# EAGLE design Op-Amp Clock Generator (EAGLE 9.6.2)
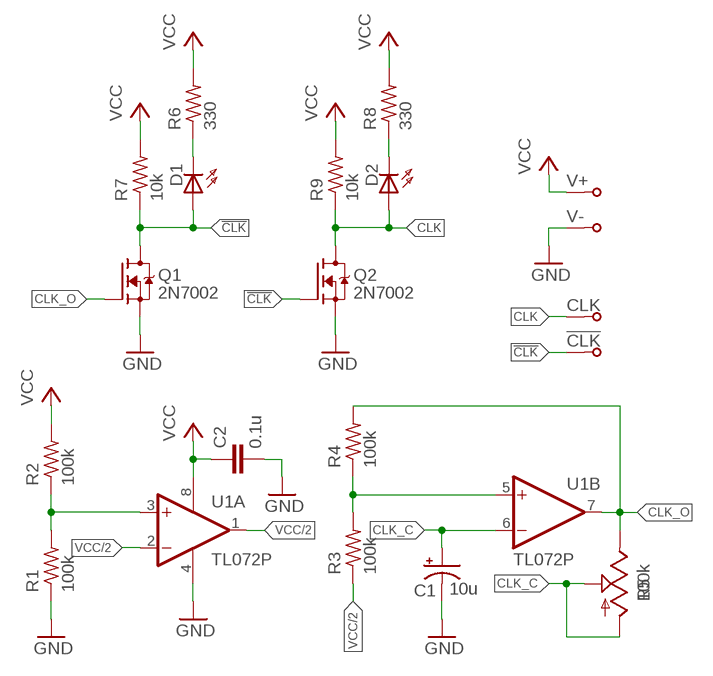
[diagram p0: schematic, sheet 1]

## Parts
!CLK  TPTHT  [PROTOPAD-THT-PAD]
C1  10u  CAP_POLLYTIC_V  [TT2D5]
C2  0.1u  CAP0603  [C0603]
CLK  TPTHT  [PROTOPAD-THT-PAD]
D1  LED0603  [CHIP-LED0603]
D2  LED0603  [CHIP-LED0603]
Q1  2N7002  [SOT23]
Q2  2N7002  [SOT23]
R1  100k  RES0603  [R0603]
R2  100k  RES0603  [R0603]
R3  100k  RES0603  [R0603]
R4  100k  RES0603  [R0603]
R5  100k  ALPHA_POT_VERTICALVERTICAL  [ALPHA_POT_VERTICAL]
R6  330  RES0603  [R0603]
R7  10k  RES0603  [R0603]
R8  330  RES0603  [R0603]
R9  10k  RES0603  [R0603]
U1  TL072P  [DIL08]
V+  TPTHT  [PROTOPAD-THT-PAD]
V-  TPTHT  [PROTOPAD-THT-PAD]

## Nets
!CLK: !CLK.P1(S) D1.A Q1.3(D) Q2.1(G) R7.1
CLK: CLK.P1(S) D2.A Q2.3(D) R9.1
CLK_C: C1.+ R5.P$2(S) R5.P$3(A) U1.6(B:-IN)
CLK_O: Q1.1(G) R4.2 R5.P$1(E) U1.7(B:OUT)
GND: C1.- C2.2 Q1.2(S) Q2.2(S) R1.1 U1.4(P:V-) V-.P1(S)
N$1: R1.2 R2.1 U1.3(A:+IN)
N$2: R3.2 R4.1 U1.5(B:+IN)
N$3: D1.C(K) R6.1
N$6: D2.C(K) R8.1
VCC: C2.1 R2.2 R6.2 R7.2 R8.2 R9.2 U1.8(P:V+) V+.P1(S)
VCC/2: R3.1 U1.1(A:OUT) U1.2(A:-IN)

## Library data of the parts
!CLK CLK V+ V- = ellajameson-core:TP
C1 = ellajameson-core:CAP_POL: POLARIZED CAPACITOR, American symbol
C2 = ellajameson-core:CAP
D1 D2 = ellajameson-core:LED
Q1 Q2 = ellajameson-core:2N7002
R1-R4 R6-R9 = ellajameson-core:RES
R5 = ellajameson-core:ALPHA_POT_VERTICAL
U1 = ellajameson-core:TL072: OP AMP

## Board
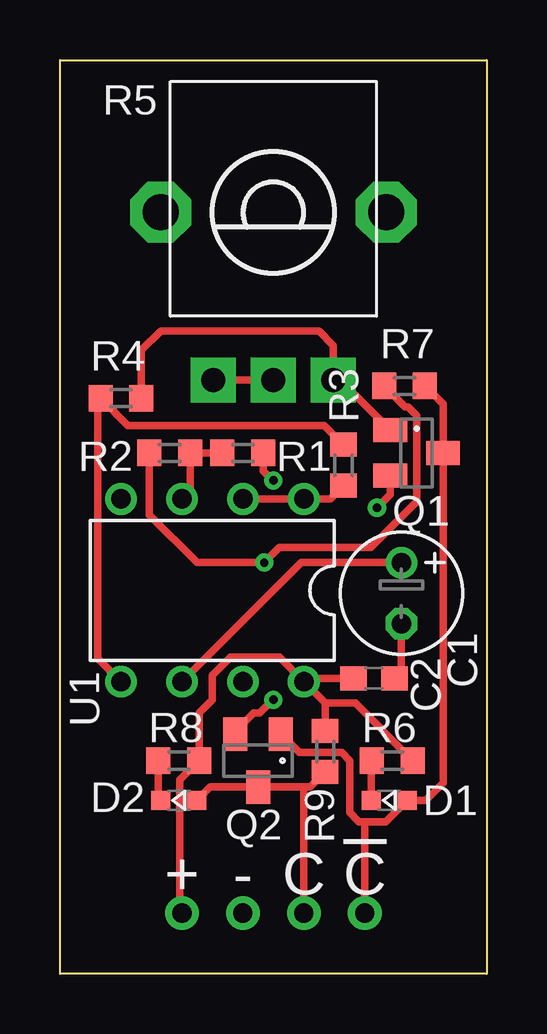
[diagram p1: board, top side]
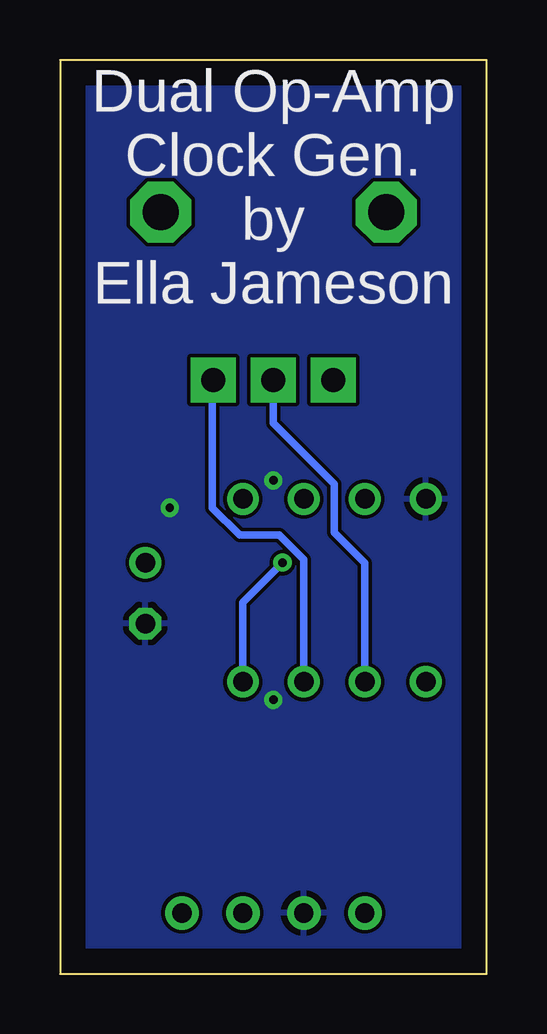
[diagram p2: board, bottom side, seen from below]

Size 17.78 x 38.1 mm. Coordinates in mm from the lower left corner, seen from the top.
Outline: 0,0 0,38.1 17.78,38.1 17.78,0 0,0
Copper layers (1*16): Top 0.035mm / dielectric 1.5mm / Bottom 0.035mm
Design rules "default": minimum track width 6mil, minimum drill 0.35mm, track to track 6mil, track to pad 6mil, pad to pad 6mil, via to via 6mil, smd to smd 6mil, copper to edge 40mil, drill to drill 6mil, minimum pad ring 10mil, minimum via ring 8mil, stop-mask expansion 4mil, vias tented up to drill 0mil, thermal gap 10mil

### Footprints (pad centres in the part's own frame; a part is rotated, then mirrored left to right if it is on the bottom)
PROTOPAD-THT-PAD = drill 0.8 pad 1.4: P1 0,0
TT2D5 = drill 0.813: + -1.27,0 | drill 0.813 octagon: - 1.27,0
C0603 = smd 1.1 x 1: 1 -0.85,0; 2 0.85,0
CHIP-LED0603 = smd 0.8 x 0.8: A 0,-0.75; C 0,0.75
SOT23 = smd 1 x 1.4: 1 -0.95,-1.1; 2 0.95,-1.1; 3 0,1.1
R0603 = smd 1 x 1.1: 1 -0.85,0; 2 0.85,0
ALPHA_POT_VERTICAL = drill 1 pad 1.88 square: P$1 -2.5,7; P$2 0,7; P$3 2.5,7 | drill 1.5 pad 2.54 octagon: P$4 -4.7,0; P$5 4.7,0
DIL08 = drill 0.813 pad 1.27: 1 -3.81,-3.81; 2 -1.27,-3.81; 3 1.27,-3.81; 4 3.81,-3.81; 5 3.81,3.81; 6 1.27,3.81; 7 -1.27,3.81; 8 -3.81,3.81

### Placement (x,y rotation side)
!CLK  12.7,2.54 0 top
C1  14.22,15.88 270 top
C2  13.08,12.32 0 top
CLK  10.16,2.54 0 top
D1  13.72,7.24 90 top
D2  4.95,7.24 90 top
Q1  14.86,21.72 270 top
Q2  8.26,8.89 180 top
R1  7.62,21.72 180 top
R2  4.57,21.72 180 top
R3  11.81,21.21 90 top
R4  2.54,24 0 top
R5  8.89,31.75 180 top
R6  13.84,8.89 0 top
R7  14.35,24.51 180 top
R8  4.95,8.89 0 top
R9  11.05,9.27 90 top
U1  6.35,15.99 180 top
V+  5.08,2.54 0 top
V-  7.62,2.54 0 top

### Tracks (layer width: path | path; a pad name or v marks a point on that pad's centre or on a via)
!CLK
  Top 0.305: R7.1 15.96,23.75 Q1.3 15.96,7.96 15.24,7.24 D1.A 13.58,6.35 12.7,6.35 | Q2.1 9.97,9.23 11.73,9.23 12.06,8.89 12.06,6.73 12.45,6.35 12.7,6.35 | !CLK.P1 12.7,6.35
CLK
  Top 0.305: 10.16,7.79 Q2.3 6.25,7.79 D2.A | 10.16,7.79 10.42,7.79 R9.1 | CLK.P1 10.16,7.79
CLK_C
  Top 0.305: R5.P$3 R5.P$2 | U1.6 10.04,17.14 C1.+
  Bottom 0.305: U1.6 5.08,17.13 6.35,18.4 6.35,20.43 8.89,22.97 R5.P$2
CLK_O
  Top 0.305: R4.2 3.39,26 4.19,26.8 10.79,26.8 11.39,26.2 R5.P$1 11.68,24.75 Q1.1
  Bottom 0.305: R5.P$1 11.43,24.71 11.43,19.43 10.29,18.29 8.64,18.29 7.62,17.27 U1.7
GND  (via drill 0.35)
  Top 0.305: R1.1 8.47,20.95 8.85,20.57 v8.89,20.57 | Q1.2 13.76,19.98 v13.21,19.43 | Q2.2 7.3,10.12 8.07,10.88 8.32,10.88 8.87,11.43 v8.89,11.43 | C2.2 14.22,12.61 C1.-
  pour Bottom: 0,0 0,38.1 17.78,38.1 17.78,0
N$1
  Top 0.305: R1.2 R2.1 5.42,20.14 U1.3
N$2
  Top 0.305: U1.5 1.57,13.14 1.57,23.88 R4.1 2.83,22.86 11.01,22.86 R3.2
N$3
  Top 0.305: D1.C 12.97,8.86 R6.1
N$6
  Top 0.305: R8.1 4.1,7.34 D2.C
VCC  (via drill 0.35)
  Top 0.305: R2.2 3.72,19.14 5.71,17.14 v8.51,17.14 9.14,17.78 12.95,17.78 14.86,19.68 14.86,23.28 14.52,23.62 14.39,23.62 R7.2 | U1.8 11.05,11.29 | 11.05,11.29 R9.2 | 11.05,11.29 12.29,11.29 R6.2 | U1.8 9.13,13.21 7.11,13.21 6.35,12.45 6.35,11.43 5.8,10.88 R8.2 5,8.09 5,2.62 V+.P1 | U1.8 10.3,12.32 C2.1
  Bottom 0.305: v8.51,17.14 10.16,15.49 U1.8
VCC/2
  Top 0.305: U1.2 U1.1 11.25,19.8 R3.1

### Text on the board
tPlace: + | - | C | !C
bPlace: Dual Op-Amp / Clock Gen. / by / Ella Jameson